# Altium schematic sheet SCH_02_Electrodes.SchDoc
size A4; SheetNumber: 7; SheetTotal: 14; SPICEModelCacheCJDBAQCP: <root> / <DocumentId>CJDBAQCP</DocumentId> / </root>
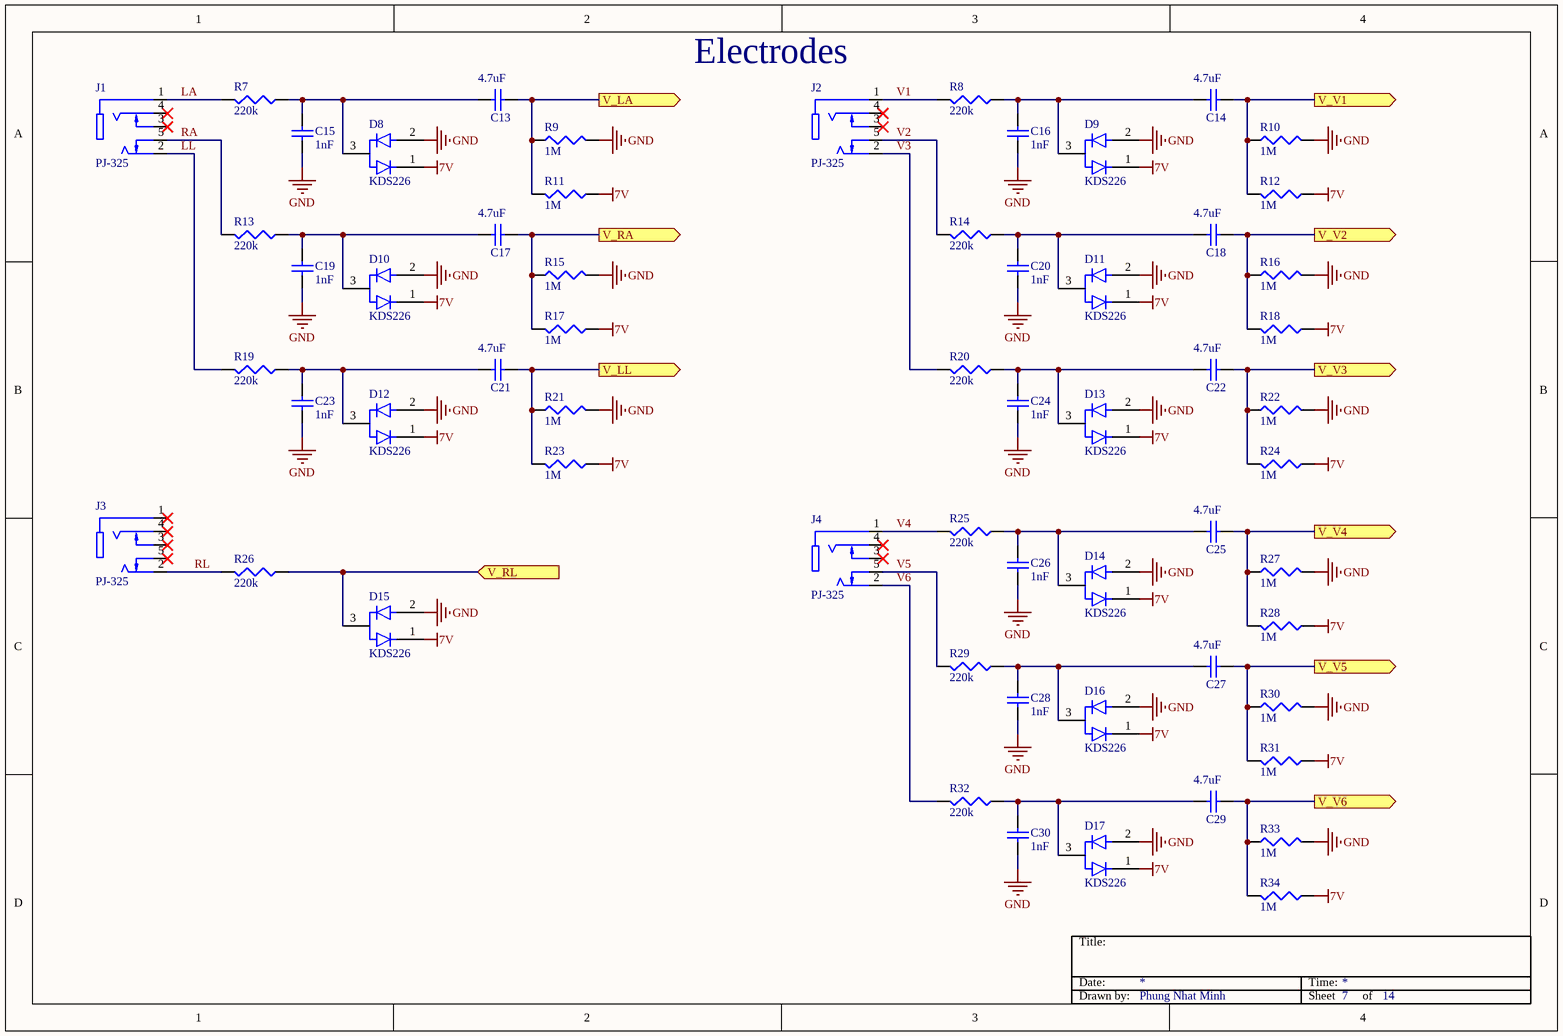
[diagram p0: SCH_02_Electrodes.SchDoc]

## Parts
C13  4.7uF  [WCAP-CSGP_0603_L1.6W0.8H0.8_Reflow]
C14  4.7uF  [WCAP-CSGP_0603_L1.6W0.8H0.8_Reflow]
C15  1nF  [WCAP-CSGP_0603_L1.6W0.8H0.8_Reflow]
C16  1nF  [WCAP-CSGP_0603_L1.6W0.8H0.8_Reflow]
C17  4.7uF  [WCAP-CSGP_0603_L1.6W0.8H0.8_Reflow]
C18  4.7uF  [WCAP-CSGP_0603_L1.6W0.8H0.8_Reflow]
C19  1nF  [WCAP-CSGP_0603_L1.6W0.8H0.8_Reflow]
C20  1nF  [WCAP-CSGP_0603_L1.6W0.8H0.8_Reflow]
C21  4.7uF  [WCAP-CSGP_0603_L1.6W0.8H0.8_Reflow]
C22  4.7uF  [WCAP-CSGP_0603_L1.6W0.8H0.8_Reflow]
C23  1nF  [WCAP-CSGP_0603_L1.6W0.8H0.8_Reflow]
C24  1nF  [WCAP-CSGP_0603_L1.6W0.8H0.8_Reflow]
C25  4.7uF  [WCAP-CSGP_0603_L1.6W0.8H0.8_Reflow]
C26  1nF  [WCAP-CSGP_0603_L1.6W0.8H0.8_Reflow]
C27  4.7uF  [WCAP-CSGP_0603_L1.6W0.8H0.8_Reflow]
C28  1nF  [WCAP-CSGP_0603_L1.6W0.8H0.8_Reflow]
C29  4.7uF  [WCAP-CSGP_0603_L1.6W0.8H0.8_Reflow]
C30  1nF  [WCAP-CSGP_0603_L1.6W0.8H0.8_Reflow]
D8  KDS226  [DIO_BAV99]
D9  KDS226  [DIO_BAV99]
D10  KDS226  [DIO_BAV99]
D11  KDS226  [DIO_BAV99]
D12  KDS226  [DIO_BAV99]
D13  KDS226  [DIO_BAV99]
D14  KDS226  [DIO_BAV99]
D15  KDS226  [DIO_BAV99]
D16  KDS226  [DIO_BAV99]
D17  KDS226  [DIO_BAV99]
J1  value PJ-325  [3.5 mm, Strereo]  (hidden comment: PJ-324)
J2  value PJ-325  [3.5 mm, Strereo]  (hidden comment: PJ-324)
J3  value PJ-325  [3.5 mm, Strereo]  (hidden comment: PJ-324)
J4  value PJ-325  [3.5 mm, Strereo]  (hidden comment: PJ-324)
R7  220k  [WRIS-PSMB_0603_L1.6W0.8H0.35]
R8  220k  [WRIS-PSMB_0603_L1.6W0.8H0.35]
R9  1M  [WRIS-PSMB_0603_L1.6W0.8H0.35]
R10  1M  [WRIS-PSMB_0603_L1.6W0.8H0.35]
R11  1M  [WRIS-PSMB_0603_L1.6W0.8H0.35]
R12  1M  [WRIS-PSMB_0603_L1.6W0.8H0.35]
R13  220k  [WRIS-PSMB_0603_L1.6W0.8H0.35]
R14  220k  [WRIS-PSMB_0603_L1.6W0.8H0.35]
R15  1M  [WRIS-PSMB_0603_L1.6W0.8H0.35]
R16  1M  [WRIS-PSMB_0603_L1.6W0.8H0.35]
R17  1M  [WRIS-PSMB_0603_L1.6W0.8H0.35]
R18  1M  [WRIS-PSMB_0603_L1.6W0.8H0.35]
R19  220k  [WRIS-PSMB_0603_L1.6W0.8H0.35]
R20  220k  [WRIS-PSMB_0603_L1.6W0.8H0.35]
R21  1M  [WRIS-PSMB_0603_L1.6W0.8H0.35]
R22  1M  [WRIS-PSMB_0603_L1.6W0.8H0.35]
R23  1M  [WRIS-PSMB_0603_L1.6W0.8H0.35]
R24  1M  [WRIS-PSMB_0603_L1.6W0.8H0.35]
R25  220k  [WRIS-PSMB_0603_L1.6W0.8H0.35]
R26  220k  [WRIS-PSMB_0603_L1.6W0.8H0.35]
R27  1M  [WRIS-PSMB_0603_L1.6W0.8H0.35]
R28  1M  [WRIS-PSMB_0603_L1.6W0.8H0.35]
R29  220k  [WRIS-PSMB_0603_L1.6W0.8H0.35]
R30  1M  [WRIS-PSMB_0603_L1.6W0.8H0.35]
R31  1M  [WRIS-PSMB_0603_L1.6W0.8H0.35]
R32  220k  [WRIS-PSMB_0603_L1.6W0.8H0.35]
R33  1M  [WRIS-PSMB_0603_L1.6W0.8H0.35]
R34  1M  [WRIS-PSMB_0603_L1.6W0.8H0.35]

## Ports
V_LA (out, see Schematic_Top[1A], SCH_03_Instrumentation_Amplifier[1A], SCH_05_WCT_RLD[1A]), V_LL (out, see Schematic_Top[1B], SCH_03_Instrumentation_Amplifier[1A], SCH_05_WCT_RLD[1B]), V_RA (out, see Schematic_Top[1B], SCH_03_Instrumentation_Amplifier[1A], SCH_05_WCT_RLD[1B]), V_RL (in, see Schematic_Top[1B], SCH_05_WCT_RLD[2D]), V_V1 (out, see Schematic_Top[1C], SCH_04_Chest_Lead_Amplifier[1B]), V_V2 (out, see Schematic_Top[1C], SCH_04_Chest_Lead_Amplifier[3B]), V_V3 (out, see Schematic_Top[1C], SCH_04_Chest_Lead_Amplifier[1C]), V_V4 (out, see Schematic_Top[1C], SCH_04_Chest_Lead_Amplifier[3C]), V_V5 (out, see Schematic_Top[1C], SCH_04_Chest_Lead_Amplifier[1D]), V_V6 (out, see Schematic_Top[1C], SCH_04_Chest_Lead_Amplifier[3D])

## Nets
7V: D8.1 D9.1 D10.1 D11.1 D12.1 D13.1 D14.1 D15.1 D16.1 D17.1 R11.1 R12.1 R17.1 R18.1 R23.1 R24.1 R28.1 R31.1 R34.1
GND: C15.2 C16.2 C19.2 C20.2 C23.2 C24.2 C26.2 C28.2 C30.2 D8.2 D9.2 D10.2 D11.2 D12.2 D13.2 D14.2 D15.2 D16.2 D17.2 R9.2 R10.2 R15.2 R16.2 R21.2 R22.2 R27.2 R30.2 R33.2
LA: J1.1 R7.2
LL: J1.2 R19.2
RA: J1.5 R13.2
RL: J3.2 R26.2
V1: J2.1 R8.2
V2: J2.5 R14.2
V3: J2.2 R20.2
V4: J4.1 R25.2
V5: J4.5 R29.2
V6: J4.2 R32.2
V_LA: C13.2 R9.1 R11.2 ; port V_LA
V_LL: C21.2 R21.1 R23.2 ; port V_LL
V_RA: C17.2 R15.1 R17.2 ; port V_RA
V_RL: D15.3 R26.1 ; port V_RL
V_V1: C14.2 R10.1 R12.2 ; port V_V1
V_V2: C18.2 R16.1 R18.2 ; port V_V2
V_V3: C22.2 R22.1 R24.2 ; port V_V3
V_V4: C25.2 R27.1 R28.2 ; port V_V4
V_V5: C27.2 R30.1 R31.2 ; port V_V5
V_V6: C29.2 R33.1 R34.2 ; port V_V6
NetC13_1: C13.1 C15.1 D8.3 R7.1
NetC14_1: C14.1 C16.1 D9.3 R8.1
NetC17_1: C17.1 C19.1 D10.3 R13.1
NetC18_1: C18.1 C20.1 D11.3 R14.1
NetC21_1: C21.1 C23.1 D12.3 R19.1
NetC22_1: C22.1 C24.1 D13.3 R20.1
NetC25_1: C25.1 C26.1 D14.3 R25.1
NetC27_1: C27.1 C28.1 D16.3 R29.1
NetC29_1: C29.1 C30.1 D17.3 R32.1

Not connected (* = marked no-connect by the designer): J1 3* 4*; J2 3* 4*; J3 1* 3* 4* 5*; J4 3* 4*

## Notes on the sheet
- (near J2) Electrodes
- Title:
- Date:
- Time:
- Drawn by:
- Phung Nhat Minh
- Sheet
- of

## Library data of the parts
C13 C14 C17 C18 C21 C22 C25 C27 C29 = 885012106012: WCAP-CSGP Multilayer Ceramic Chip Capacitor, General Purpose, size 0603, X5R, 4.7uF, 10VDC; Manufacturer: Wurth Elektronik; Case/Size Code: 0603; Capacitance Tolerance: +/-20%; Dissipation Factor: 10%; Insulation Resistance: 0.02GOhm; Rated Voltage (DC): 10V; Technical Reference: X5R0603475M010DFCT10000; Manufacturer Part Number: 885012106012; Category: Multilayer Ceramic Chip Capacitors; Match Code: WCAP-CSGP; ComponentLink1Description: Website Link; ComponentLink1URL: https://www.we-online.com/redexpert/article/885012106012?ad; ComponentLink2Description: Datasheet Link; ComponentLink2URL: https://www.we-online.com/redexpert/spec/885012106012?ad; Mount: Surface Mount; Operating Temperature Max: 85°C; Operating Temperature Min: -55°C; Packaging: Tape and Reel; Length: 1.6mm; Width: 0.8mm; Height: 0.8mm; Capacitance: 4.7uF; Ceramic Type: X5R
C15 C16 C19 C20 C23 C24 C26 C28 C30 = 885012006063: WCAP-CSGP Multilayer Ceramic Chip Capacitor, General Purpose, size 0603, NP0, 1nF, 50VDC; Manufacturer: Wurth Elektronik; Case/Size Code: 0603; Capacitance Tolerance: +/-5%; Insulation Resistance: 10GOhm; Q Factor: 1000; Rated Voltage (DC): 50V; Technical Reference: NP00603102J050DFCT10000; Manufacturer Part Number: 885012006063; Category: Multilayer Ceramic Chip Capacitors; Match Code: WCAP-CSGP; ComponentLink1Description: Website Link; ComponentLink1URL: https://www.we-online.com/redexpert/article/885012006063?ad; ComponentLink2Description: Datasheet Link; ComponentLink2URL: https://www.we-online.com/redexpert/spec/885012006063?ad; Mount: Surface Mount; Operating Temperature Max: 125°C; Operating Temperature Min: -55°C; Packaging: Tape and Reel; Length: 1.6mm; Width: 0.8mm; Height: 0.8mm; Capacitance: 1nF; Ceramic Type: NP0
D8-D17 = KDS226: Diode Array 1 Pair Series Connection Standard 100V 215mA (DC) Surface Mount TO-236-3, SC-59, SOT-23-3; MP: BAV99; MF: ON Semiconductor; Price: None; Availability: In Stock; Package: SOT-23-3 Motorola; SnapEDA_Link: https://www.snapeda.com/parts/BAV99/Onsemi/view-part/?ref=snap; Check_prices: https://www.snapeda.com/parts/BAV99/Onsemi/view-part/?ref=eda; Value: *; Purchase-URL: https://pricing.snapeda.com/search/part/BAV99/?ref=eda
J1-J4 = PJ-324: Jack 3.5 3-Pole 5-Pin; ComponentLink1Description: Buy; ComponentLink1URL: https://www.thegioiic.com/pj-324-cong-audio-3-5mm-3-cuc-5-chan-han-pcb
R7-R34 = 580060716001: WRIS-PSMB Metal Plate Resistor, SMT, size 0603, 0.33W, 5mΩ, +/-1%; Manufacturer: Wurth Elektronik; Case/Size Code: 0603; Rated Current: 8.12A; Technical Reference: MB0603R005F103KAATP0000; Temperature Coefficient of Resistance: +/-100ppm/°C; Manufacturer Part Number: 580060716001; Category: Metal Plate Resistors; Match Code: WRIS-PSMB; ComponentLink1Description: Website Link; ComponentLink1URL: https://www.we-online.com/redexpert/article/580060716001?ad; ComponentLink2Description: Datasheet Link; ComponentLink2URL: https://www.we-online.com/redexpert/spec/580060716001?ad; Mount: Surface Mount; Operating Temperature Max: 155°C; Operating Temperature Min: -55°C; Packaging: Tape and Reel; Length: 1.6mm; Width: 0.8mm; Height: 0.35mm; Rated Power: 0.33W; Resistance: 5mΩ; Resistance Tolerance: +/-1%